# Altium project CoilPAD_HEX1.PrjPcb
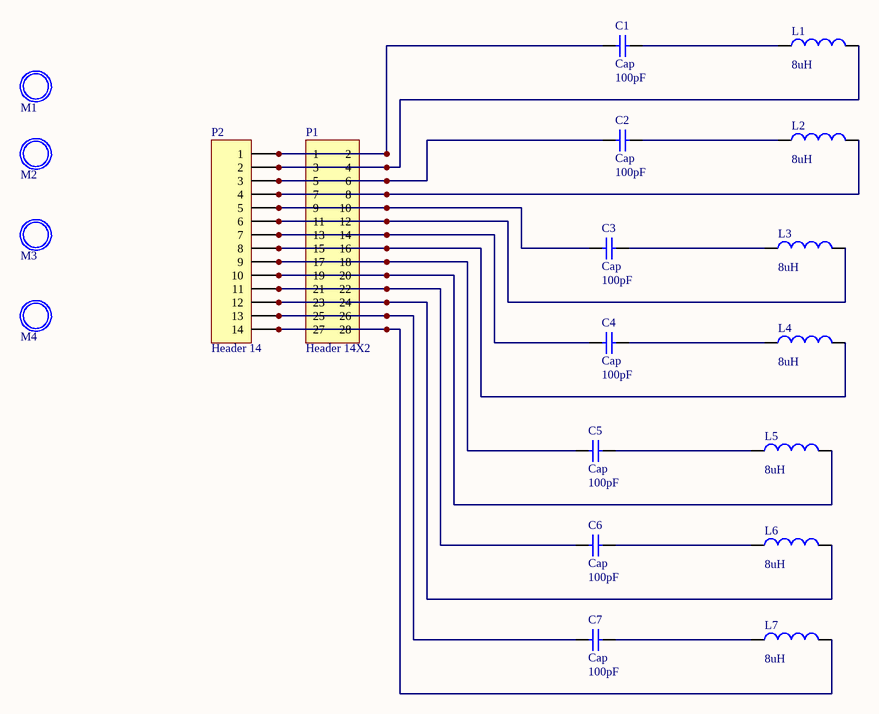
[diagram p0: HEX1.SchDoc]
1 sheet, 20 parts. Net scope: global (net labels, ports and power ports of the same name join across sheets).
Board files: HEXPAD1.PcbDoc, PCB1.PcbDoc, PCB2.PcbDoc

## Sheet HEX1.SchDoc
size A4

### Parts
C1  Cap  value 100pF  [CAP_MKT]
C2  Cap  value 100pF  [CAP_MKT]
C3  Cap  value 100pF  [CAP_MKT]
C4  Cap  value 100pF  [CAP_MKT]
C5  Cap  value 100pF  [CAP_MKT]
C6  Cap  value 100pF  [CAP_MKT]
C7  Cap  value 100pF  [CAP_MKT]
L1  value 8uH  [HEXAGON_50-15]  (hidden comment: Inductor)  (net tie)
L2  value 8uH  [HEXAGON_50-15]  (hidden comment: Inductor)  (net tie)
L3  value 8uH  [HEXAGON_50-15]  (hidden comment: Inductor)  (net tie)
L4  value 8uH  [HEXAGON_50-15]  (hidden comment: Inductor)  (net tie)
L5  value 8uH  [HEXAGON_50-15]  (hidden comment: Inductor)  (net tie)
L6  value 8uH  [HEXAGON_50-15]  (hidden comment: Inductor)  (net tie)
L7  value 8uH  [HEXAGON_50-15]  (hidden comment: Inductor)  (net tie)
M1  Screw  [Board Screw 1]  (value not drawn)
M2  Screw  [Board Screw 1]  (value not drawn)
M3  Screw  [Board Screw 1]  (value not drawn)
M4  Screw  [Board Screw 1]  (value not drawn)
P1  Header 14X2  [HDR2X14]
P2  Header 14  [HDR1X14]

### Nets
NetC1_1: C1.1 P1.1 P1.2 P2.1
NetC1_2: C1.2 L1.1
NetC2_1: C2.1 P1.5 P1.6 P2.3
NetC2_2: C2.2 L2.1
NetC3_1: C3.1 P1.9 P1.10 P2.5
NetC3_2: C3.2 L3.1
NetC4_1: C4.1 P1.13 P1.14 P2.7
NetC4_2: C4.2 L4.1
NetC5_1: C5.1 P1.17 P1.18 P2.9
NetC5_2: C5.2 L5.1
NetC6_1: C6.1 P1.21 P1.22 P2.11
NetC6_2: C6.2 L6.1
NetC7_1: C7.1 P1.25 P1.26 P2.13
NetC7_2: C7.2 L7.1
NetL1_2: L1.2 P1.3 P1.4 P2.2
NetL2_2: L2.2 P1.7 P1.8 P2.4
NetL3_2: L3.2 P1.11 P1.12 P2.6
NetL4_2: L4.2 P1.15 P1.16 P2.8
NetL5_2: L5.2 P1.19 P1.20 P2.10
NetL6_2: L6.2 P1.23 P1.24 P2.12
NetL7_2: L7.2 P1.27 P1.28 P2.14

### Library data of the parts
C1-C7 = Cap: Capacitor; Published: 8-Jun-2000; LatestRevisionDate: 17-Jul-2002; LatestRevisionNote: Re-released for DXP Platform.; PackageReference: RAD-0.3; Publisher: Altium Limited; PackageDescription: Radial Cap, Thru-Hole; 2 Leads; 0.3 in Pin Spacing
L1-L7 = Inductor: Code_IEC: 1005; Published: 8-Jun-2000; LatestRevisionDate: 29-May-2009; LatestRevisionNote: IPC-7351 Footprint Added.; PackageReference: 0402-A; Publisher: Altium Limited; PackageDescription: Chip Inductor; Code_JEITA: 0402
M1-M4 = Board Screw: Board Screw With Spacer
P1 = Header 14X2: Header, 14-Pin, Dual row; LatestRevisionDate: 17-Jul-2002; LatestRevisionNote: Re-released for DXP Platform.; Publisher: Altium Limited
P2 = Header 14: Header, 14-Pin; LatestRevisionDate: 17-Jul-2002; LatestRevisionNote: Re-released for DXP Platform.; Publisher: Altium Limited